# Altium schematic sheet PW.SchDoc
size A4
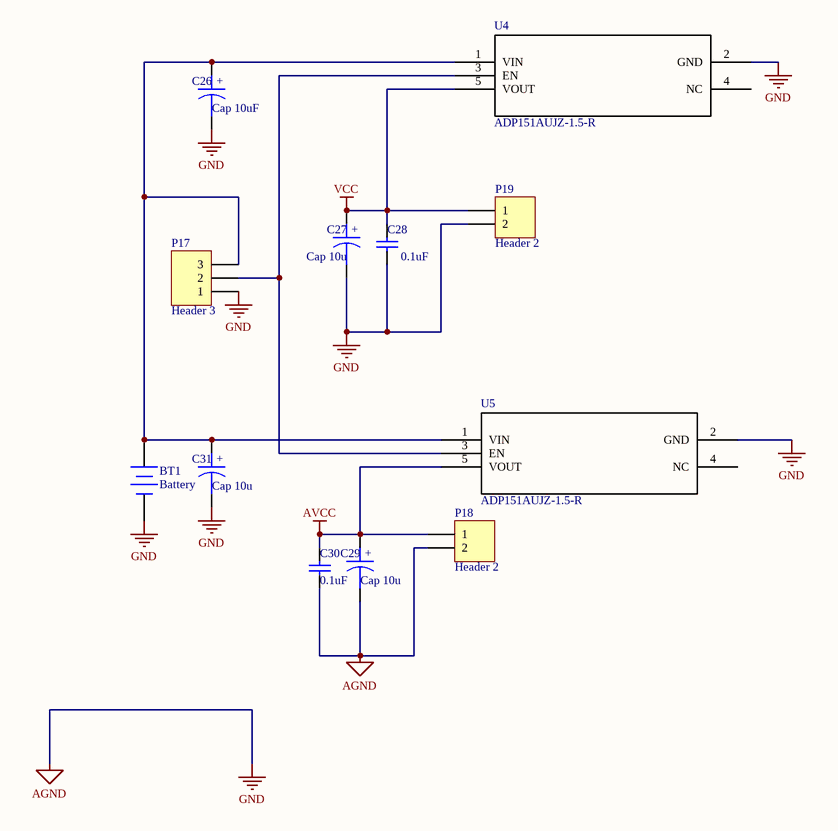
[diagram p0: PW.SchDoc]

## Parts
BT1  Battery  [BAT-2]
C26  Cap 10uF  [C1206]
C27  Cap 10u  [C1206]
C28  value 0.1uF  [0603]  (hidden comment: Cap 100nF)
C29  Cap 10u  [C1206]
C30  value 0.1uF  [0603]  (hidden comment: Cap 100nF)
C31  Cap 10u  [C1206]
P17  Header 3  [HDR1X3]
P18  Header 2  [HDR1X2]
P19  Header 2  [HDR1X2]
U4  ADP151AUJZ-1.5-R  [UJ_5]
U5  ADP151AUJZ-1.5-R  [UJ_5]

## Nets
AGND: BT1.2(-) C26.2 C27.2 C28.1 C29.2 C30.1 C31.2 P17.1 P18.2 P19.2 U4.2(GND) U5.2(GND)  [also labelled GND]
AVCC: C29.1 C30.2 P18.1 U5.5(VOUT)
VCC: C27.1 C28.2 P19.1 U4.5(VOUT)
NetBT1_1: BT1.1(+) C26.1 C31.1 P17.3 U4.1(VIN) U5.1(VIN)
NetP17_2: P17.2 U4.3(EN) U5.3(EN)

Not connected (* = marked no-connect by the designer): U4 4(NC); U5 4(NC)

## Notes on the sheet
- (in symbol CAPACITOR POL) +

## Library data of the parts
BT1 = Battery: Multicell Battery; Published: 24-Mar-1999; LatestRevisionDate: 17-Jul-2002; LatestRevisionNote: Re-released for DXP Platform.; PackageReference: BAT-2; Publisher: Altium Limited; PackageDescription: Battery; 2 Leads
C26 C27 C29 C31 = CAPACITOR POL: Capacitor
C28 C30 = Cap: Capacitor; Published: 8-Jun-2000; LatestRevisionDate: 17-Jul-2002; LatestRevisionNote: Re-released for DXP Platform.; PackageReference: RAD-0.3; Publisher: Altium Limited; PackageDescription: Radial Cap, Thru-Hole; 2 Leads; 0.3 in Pin Spacing
P17 = Header 3: Header, 3-Pin; LatestRevisionDate: 17-Jul-2002; LatestRevisionNote: Re-released for DXP Platform.; Publisher: Altium Limited
P18 P19 = Header 2: Header, 2-Pin; LatestRevisionDate: 17-Jul-2002; LatestRevisionNote: Re-released for DXP Platform.; Publisher: Altium Limited
U4 U5 = ADP151AUJZ-1.5-R: Imported; RefDes: RefDes; Type: DEV; Value: Value